# Altium project B100.PrjPcb (part 1 of 3)
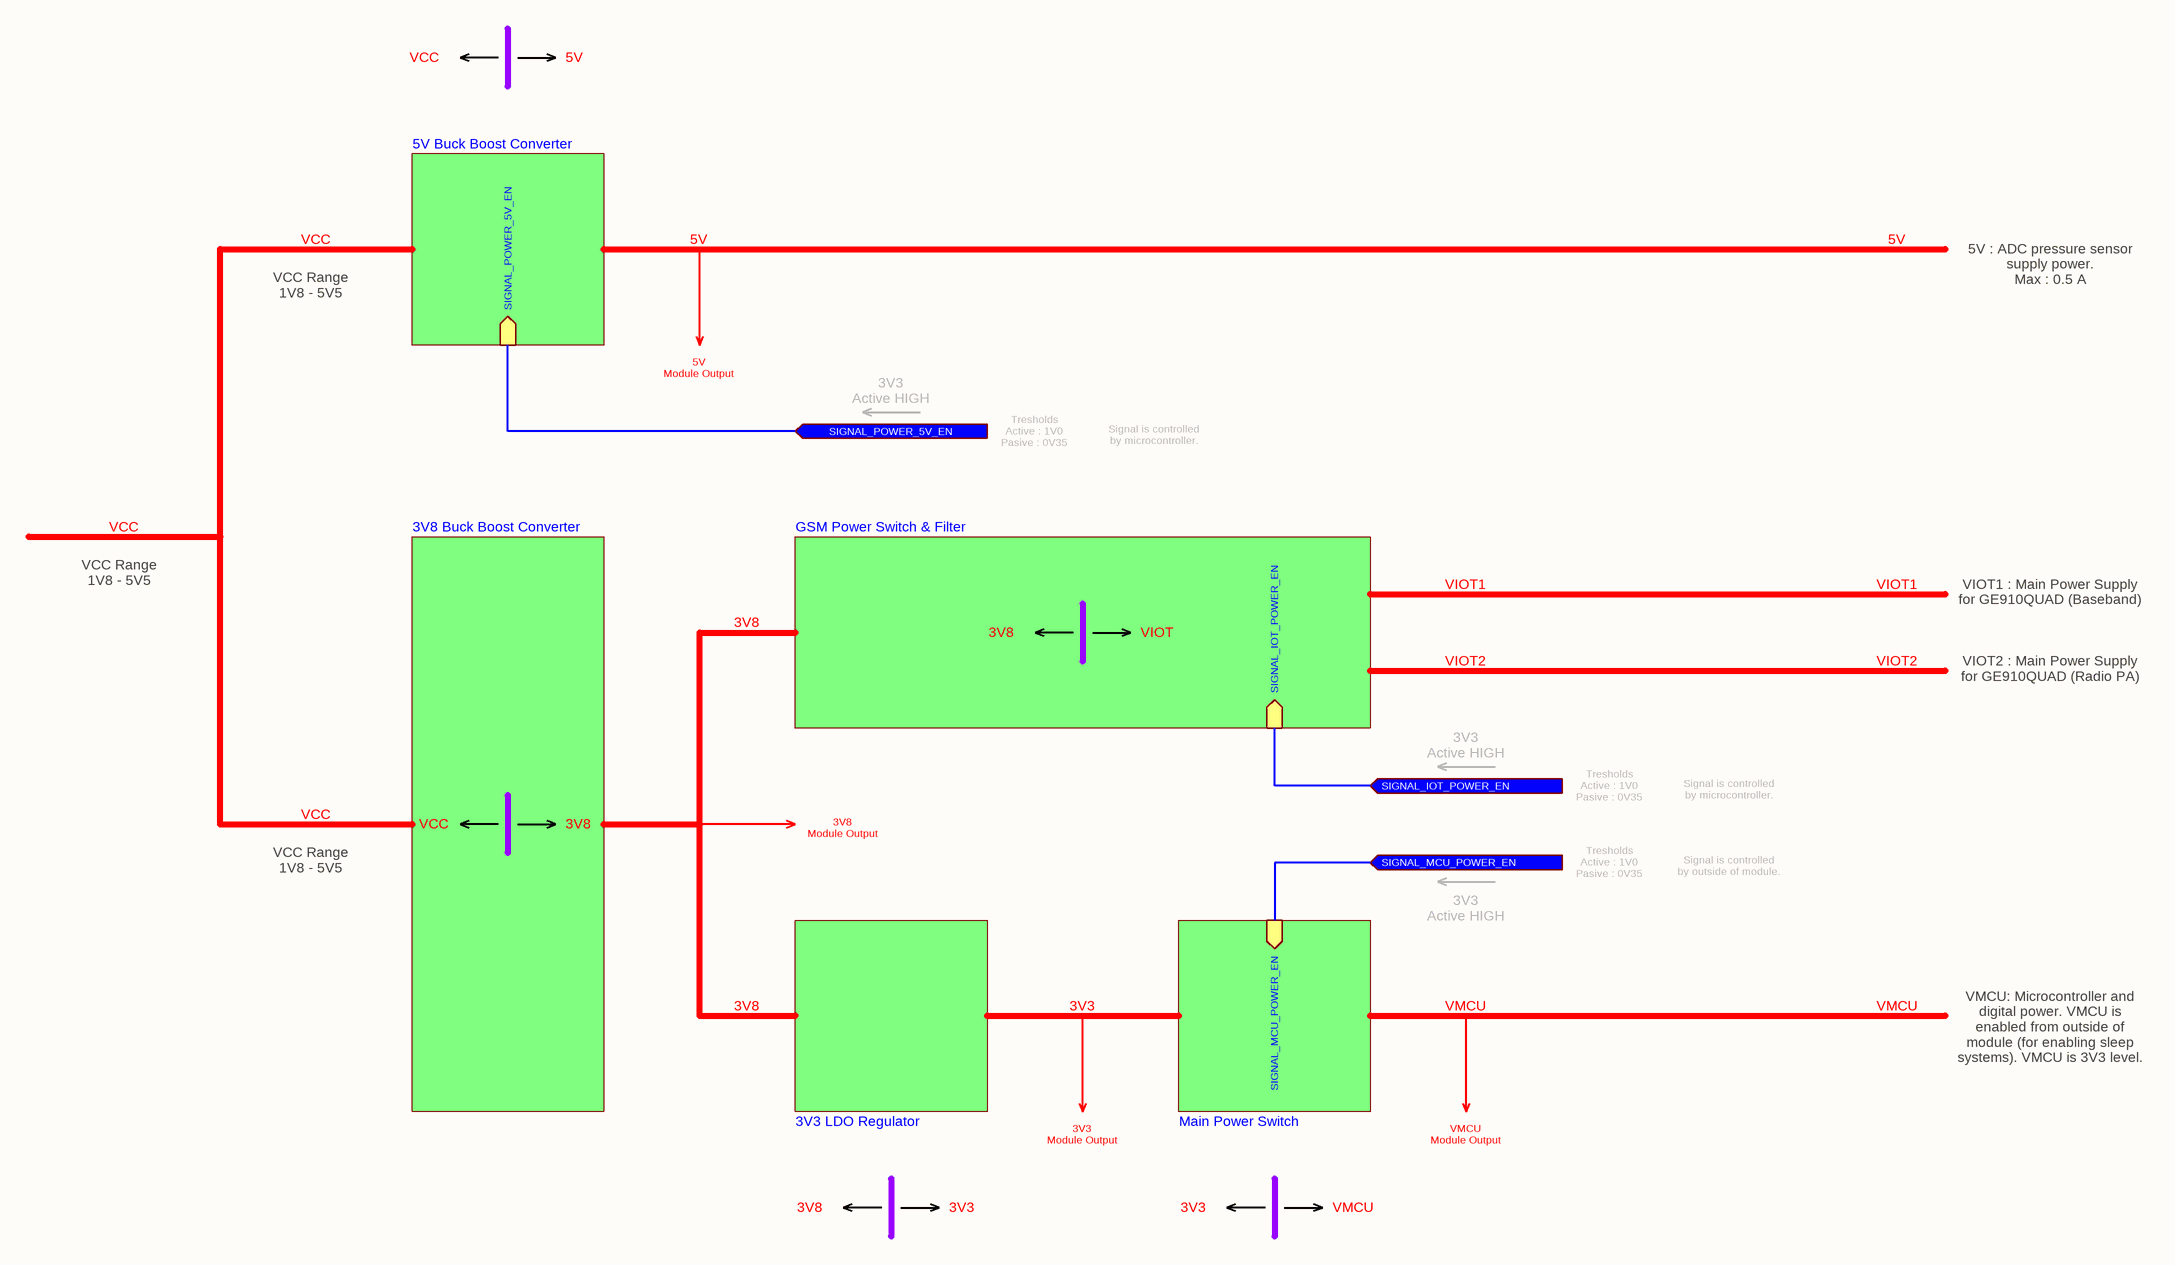
[diagram p0: Power Source.SchDoc]
Version_: AA; Title_: Power Source Segment Block Diagram; Revision_: R06; Product_ID_: -; Product_Desc_: GSM Iot Based Plug&Play SOM; Phone_: +90 506 7444300; Organization_: Ovoo Electronics; Module_ID_: B100; link_: http://www.ovoo.me; Git_Repo_Address_: https://www.github.com/akkoyun/B100; Engineer_: Mehmet Günce Akkoyun; Customer_: -; Address4_: Turkiye; Address3_: Meram / Konya; Address2_: Birgül Apt. No: 19/6; Address1_: Necip Fazýl Mah. Ortaýrmak Sok.
26 sheets, 171 parts. Net scope: hierarchical (ports join the sheet entries above them; power ports are global).
Board file: B100AA PCB R1.PcbDoc
Sheets:
  Power Source.SchDoc
    3V8 Buck Boost Converter = 3V8 Buck Boost Converter.SchDoc
    5V Buck Boost Converter = 5V Buck Boost Converter.SchDoc
    GSM Power Switch & Filter = GSM Power.SchDoc
    Main Power Switch = Main Power Switch.SchDoc
  GE910QUAD Modem.SchDoc
  GSM LED Indicators.SchDoc
  Master MicroController.SchDoc
    Master MicroController Core = Master MicroController Core.SchDoc
    PORT A = Master MicroController Port A.SchDoc
    PORT B = Master MicroController Port B.SchDoc
    PORT C = Master MicroController Port C.SchDoc
    PORT E = Master MicroController Port E.SchDoc
    PORT F = Master MicroController Port F.SchDoc
    PORT G = Master MicroController Port G.SchDoc
    PORT H = Master MicroController Port H.SchDoc
    PORT K = Master MicroController Port K.SchDoc
    Serial Communication = Master MicroController Serial Communication Port.SchDoc
  FOTA MicroController.SchDoc
  SD Card.SchDoc
  ICSP Burn Buffer.SchDoc
  I2C Network.SchDoc
    I2C Real Time Clock = Real Time Clock.SchDoc
  Filter Capacitors - Signal IoT.SchDoc
  Filter Capacitors - IoT UART.SchDoc
  Filter Capacitors - Port F.SchDoc

## Sheet Power Source.SchDoc: Power Architechture Block Diagram
size A3; ApprovedBy: Mehmet Günce Akkoyun; CheckedBy: Mehmet Günce Akkoyun; Author: Mehmet Günce Akkoyun; CompanyName: Ovoo Electronics; DrawnBy: Mehmet Günce Akkoyun; Engineer: Mehmet Günce Akkoyun; Organization: Ovoo Electronics; Address1: Necip Fazýl Mah. Ortaýrmak Sok.; Address2: Birgül Apt. No: 19/6; Address3: Meram / Konya; Address4: Turkiye; DocumentNumber: 2; Revision: R06; SheetNumber: 2; SheetTotal: 54

### Sub-sheets
3V3 LDO Regulator = 3V3 LDO Regulator.SchDoc (file not in this document): no entries
3V8 Buck Boost Converter = 3V8 Buck Boost Converter.SchDoc: no entries
5V Buck Boost Converter = 5V Buck Boost Converter.SchDoc: SIGNAL_POWER_5V_EN (in)
GSM Power Switch & Filter = GSM Power.SchDoc: SIGNAL_IOT_POWER_EN (in)
Main Power Switch = Main Power Switch.SchDoc: SIGNAL_MCU_POWER_EN (in)

### Ports
SIGNAL_IOT_POWER_EN (in), SIGNAL_MCU_POWER_EN (in), SIGNAL_POWER_5V_EN (in)

### Nets
NetC4_2: port SIGNAL_IOT_POWER_EN, sheet GSM Power Switch & Filter/SIGNAL_IOT_POWER_EN
NetC11_2: port SIGNAL_MCU_POWER_EN, sheet Main Power Switch/SIGNAL_MCU_POWER_EN
NetC234_2: port SIGNAL_POWER_5V_EN, sheet 5V Buck Boost Converter/SIGNAL_POWER_5V_EN

### Notes on the sheet
- VCC
- 5V
- VCC Range
  1V8 - 5V5
- 5V
  Module Output
- 5V : ADC pressure sensor supply power.
  Max : 0.5 A
- 3V3
  Active HIGH
- Tresholds
  Active : 1V0
  Pasive : 0V35
- Signal is controlled by microcontroller.
- 3V8
- VIOT
- VIOT2
- VIOT1
- VIOT1 : Main Power Supply for GE910QUAD (Baseband)
- VIOT2 : Main Power Supply for GE910QUAD (Radio PA)
- 3V8
  Module Output
- Signal is controlled by outside of module.
- 3V3
- VMCU
- 3V3
  Module Output
- VMCU
  Module Output
- VMCU: Microcontroller and digital power. VMCU is enabled from outside of module (for enabling sleep systems). VMCU is 3V3 level.
- Engineer
- All Rights are reserved to Customer and Engineer. [2021]
- Size:
- Date:
- A3
- Project :
- Time:
- Sheet
- of
- Customer
- Product ID
- Module ID
- Version
- File:
- Revision

## Sheet 3V8 Buck Boost Converter.SchDoc: 3V8 DC/DC Buck Boost Converter
size A4; ApprovedBy: Mehmet Günce Akkoyun; CheckedBy: Mehmet Günce Akkoyun; Author: Mehmet Günce Akkoyun; CompanyName: Ovoo Electronics; DrawnBy: Mehmet Günce Akkoyun; Engineer: Mehmet Günce Akkoyun; Organization: Ovoo Electronics; Address1: Necip Fazýl Mah. Ortaýrmak Sok.; Address2: Birgül Apt. No: 19/6; Address3: Meram / Konya; Address4: Turkiye; DocumentNumber: 3; Revision: R06; SheetNumber: 3; SheetTotal: 54
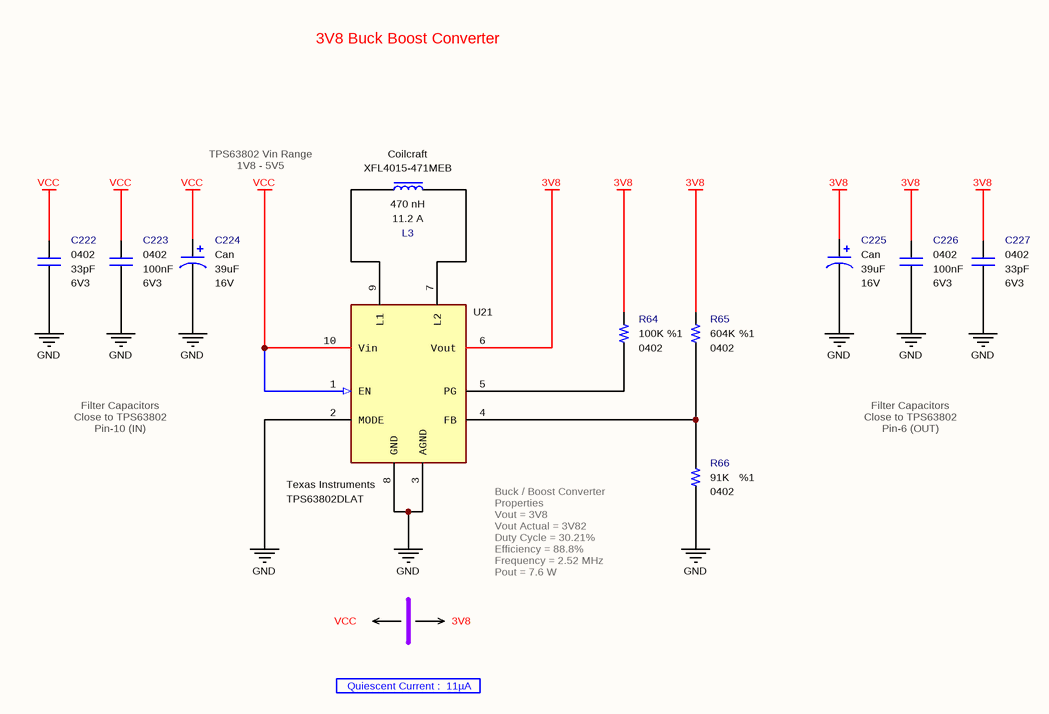
[diagram p1: 3V8 Buck Boost Converter.SchDoc]

### Parts
C222  value 33pF  Case: 0402  Voltage: 6V3  [CAPACITOR_0402]  (hidden comment: Multilayer Ceramic Capacitor)
C223  value 100nF  Case: 0402  Voltage: 6V3  [CAPACITOR_0402]  (hidden comment: Multilayer Ceramic Capacitor)
C224  value 39uF  Case: Can  Voltage: 16V  [CAPACITOR_CAN-B6]  (hidden comment: Aluminium Organic Polymer Capacitors)
C225  value 39uF  Case: Can  Voltage: 16V  [CAPACITOR_CAN-B6]  (hidden comment: Aluminium Organic Polymer Capacitors)
C226  value 100nF  Case: 0402  Voltage: 6V3  [CAPACITOR_0402]  (hidden comment: Multilayer Ceramic Capacitor)
C227  value 33pF  Case: 0402  Voltage: 6V3  [CAPACITOR_0402]  (hidden comment: Multilayer Ceramic Capacitor)
L3  value 470 nH  Maximum DC Current: 11.2 A  Manufacturer Part Number: XFL4015-471MEB  Manufacturer Name: Coilcraft  [INDUCTOR_XFL4015]  (hidden comment: Fixed Inductor)
R64  value 100K  Tolerance: %1  Case: 0402  [RESISTOR_0402]  (hidden comment: Thick Film Resistor)
R65  value 604K  Tolerance: %1  Case: 0402  [RESISTOR_0402]  (hidden comment: Thick Film Resistor)
R66  value 91K  Tolerance: %1  Case: 0402  [RESISTOR_0402]  (hidden comment: Thick Film Resistor)
U21  Manufacturer Part Number: TPS63802DLAT  Manufacturer Name: Texas Instruments  [VSON-10]  (hidden comment: Buck-Boost Converter)

### Nets
3V8: C225.1 C226.1 C227.2 R64.2 R65.2 U21.6(Vout)
GND: C222.1 C223.2 C224.2 C225.2 C226.2 C227.1 R66.1 U21.2(MODE) U21.3(AGND) U21.8(GND)
VCC: C222.2 C223.1 C224.1 U21.1(EN) U21.10(Vin)
NetL3_1: L3.1 U21.9(L1)
NetL3_2: L3.2 U21.7(L2)
NetR64_1: R64.1 U21.5(PG)
NetR65_1: R65.1 R66.2 U21.4(FB)

### Notes on the sheet
- 3V8 Buck Boost Converter
- TPS63802 Vin Range
  1V8 - 5V5
- Filter Capacitors
  Close to TPS63802
  Pin-10 (IN)
- Filter Capacitors
  Close to TPS63802
  Pin-6 (OUT)
- VCC
- 3V8
- Buck / Boost Converter Properties
  Vout = 3V8
  Vout Actual = 3V82
  Duty Cycle = 30.21%
  Efficiency = 88.8%
  Frequency = 2.52 MHz
  Pout = 7.6 W
- Quiescent Current :  11µA
- Engineer
- All Rights are reserved to Customer and Engineer. [2021]
- Size:
- Date:
- A4
- Project :
- Time:
- Sheet
- of
- Customer
- Product ID
- Module ID
- Version
- File:
- Revision

### Library data of the parts
C222 C227 = Capacitor - 33pF [0402-6V3]: Capacitor - 33pF [0402] (Ceramic); Manufacturer Name: Kemet; Manufacturer Part Number: C0402C330J9RACAUTO; Dielectric: X7R; Tolerance: 10%; Height: 0.5mm; Maximum Operating Temperature: +125; Minimum Operating Temperature: -55; ROHS: Yes; ComponentLink1Description: DataSheet; ComponentLink1URL: https://api.kemet.com/component-edge/download/datasheet/C0402C330J9RACAUTO.pdf; ComponentLink2Description: Mouser; ComponentLink2URL: https://www.mouser.com/Search/Refine.aspx?Keyword=80-C0402C330J9RAUTO; Supplier 1: Mouser; Supplier Part Number 1: 80-C0402C330J9RAUTO; Mouser Part Number: 80-C0402C330J9RAUTO
C223 C226 = Capacitor - 100nF [0402-6V3]: Capacitor - 100nF [0402-6V3] (Ceramic); Manufacturer Name: AVX; Manufacturer Part Number: 04026D104KAT4A; Dielectric: X5R; Tolerance: %10; Height: 0.25mm; ComponentLink1Description: Mouser; ComponentLink1URL: https://www.mouser.com.tr/ProductDetail/AVX/04026D104KAT4A?qs=sGAEpiMZZMs0AnBnWHyRQPg4iYkCw7IMED%2F4kpqgf7w%3D; ComponentLink2Description: DataSheet; ComponentLink2URL: https://www.mouser.com.tr/datasheet/2/40/cx5r-776519.pdf; ROHS: Yes; Maximum Operating Temperature: +85; Minimum Operating Temperature: -55; Supplier 1: Avnet; Supplier Part Number 1: 04026D104KAT4A; Mouser Part Number: 581-04026D104KAT4A
C224 C225 = Capacitor - 39uF [Can-16V]: Capacitor - 39uF 16V [Can] (Electrolytic); Manufacturer Name: Panasonic; Manufacturer Part Number: 16SVPC39MV; Leakage Current: 300uA; Tolerance: 20%; ESR: 27 mOhms; Height: 6mm; Maximum Operating Temperature: +105; Minimum Operating Temperature: -55; ROHS: Yes; ComponentLink1Description: DataSheet; ComponentLink1URL: https://www.mouser.com.tr/datasheet/2/315/SVPC_OS-1197065.pdf; ComponentLink2Description: Mouser; ComponentLink2URL: https://www.mouser.com.tr/ProductDetail/Panasonic/16SVPC39MV?qs=%2Fha2pyFadujpu3ATUg5hwJ6EWbTfmGGWJDu5kzoHUqwaZzNIr7t5GA%3D%3D; Supplier 1: Mouser; Supplier 2: Digi-Key; Supplier Part Number 2: P16473CT-ND; Supplier Part Number 1: 667-16SVPC39MV; Mouser Part Number: 667-16SVPC39MV
L3 = Inductor - 470 nH [SMD]: Fixed Inductors 0.47uH 20% 11.2A 8.36mOhms AEC-Q200; Height: 1.6mm; ComponentLink1Description: DataSheet; ComponentLink1URL: https://eu.mouser.com/datasheet/2/597/xfl4015-270755.pdf; ComponentLink2Description: Mouser; ComponentLink2URL: https://eu.mouser.com/ProductDetail/Coilcraft/XFL4015-471MEB?qs=VJjuEbE9QBO6UaDdUAgr%252Bw%3D%3D; Maximum DC Resistance: 8.36 mOhms; Maximum Operating Temperature: +125; Minimum Operating Temperature: -40; Tolerance: 20%; Supplier 1: Mouser; Supplier 2: Farnell; Supplier 3: Digi-Key; Supplier 4: Newark; Supplier Part Number 1: 710-7443551130; Supplier Part Number 2: 1869775; Supplier Part Number 4: 32T8562; Supplier Part Number 3: 732-1124-1-ND; Case: XFL4015; Mouser Part Number: 994-XFL4015-471MEB
R64 = Resistor - 100K: Thick Film Resistors - SMD 1/16 W 100 Kohms 1%; Manufacturer Name: Vishay; Manufacturer Part Number: CRCW0402100KFKED; Height: 0.35mm; ComponentLink1Description: DataSheet; ComponentLink1URL: https://www.mouser.com.tr/datasheet/2/427/dcrcwe3-1762152.pdf; ComponentLink2Description: Mouser; ComponentLink2URL: https://eu.mouser.com/ProductDetail/Vishay-Dale/CRCW0402100KFKED?qs=OlqPY1CiralZGKRwQ4Glcg%3D%3D; Supplier 1: Future Electronics; Supplier 2: Future Electronics; Supplier 3: Arrow; Supplier 4: Farnell; Supplier 5: Digi-Key; Supplier Part Number 1: CRCW0402100KFKED-CUTT; Supplier Part Number 2: CRCW0402100KFKED-REEL; Supplier Part Number 3: CRCW0402100KFKED; Supplier Part Number 4: 2121857; Supplier Part Number 5: 541-100KLCT-ND; Mouser Part Number: 71-CRCW0402-100K-E3
R65 = Resistor - 604K: Thick Film Resistors - SMD 1/16 W 604 Kohms 1%; Manufacturer Name: Vishay; Manufacturer Part Number: CRCW0402604KFKED; Height: 0.35mm; ComponentLink1Description: DataSheet; ComponentLink1URL: https://eu.mouser.com/datasheet/2/427/dcrcwe3-1762152.pdf; ComponentLink2Description: Mouser; ComponentLink2URL: https://eu.mouser.com/ProductDetail/Vishay-Dale/CRCW0402604KFKED?qs=DKbL89i6OEpzv5ZGRZfINw%3D%3D; Supplier 1: Mouser; Supplier 2: Digi-Key; Supplier Part Number 1: 71-CRCW0402390KFKED; Supplier Part Number 2: 541-390KLCT-ND; Mouser Part Number: 71-CRCW0402-604K-E3
R66 = Resistor - 91K: Thick Film Resistors - SMD 1/16 W 91 Kohms 1%; Manufacturer Name: Vishay; Manufacturer Part Number: CRCW040291K0FKED; Height: 0.35mm; ComponentLink1Description: DataSheet; ComponentLink1URL: https://eu.mouser.com/datasheet/2/427/dcrcwe3-1762152.pdf; ComponentLink2Description: Mouser; ComponentLink2URL: https://eu.mouser.com/ProductDetail/Vishay-Dale/CRCW040291K0FKED?qs=Po1ctqG%2F82oNfd9H7rZeFQ%3D%3D; Supplier 1: Future Electronics; Supplier 2: Arrow; Supplier 3: Farnell; Supplier 4: Newark; Supplier 5: Digi-Key; Supplier Part Number 1: CRCW040291K0FKED-REEL; Supplier Part Number 2: CRCW040291K0FKED; Supplier Part Number 3: 2121853; Supplier Part Number 4: 24W2519; Supplier Part Number 5: 541-91.0KLCT-ND; Mouser Part Number: 71-CRCW040291K0FKED
U21 = IC - TPS63802DLAT: Switching Voltage Regulators High current, high efficiency single inductor buck-boost converter 10-VSON-HR -40 to 125; ComponentLink1Description: DataSheet; ComponentLink1URL: https://www.ti.com/lit/ds/symlink/tps63802.pdf?ts=1611132560608&ref_url=https%253A%252F%252Fwww.google.com%252F; ComponentLink2Description: Mouser; ComponentLink2URL: https://www.mouser.com.tr/ProductDetail/Maxim-Integrated/MAX17055ETB%2bT?qs=sGAEpiMZZMve4%2FbfQkoj%252BAs6FTSsQJaJrD7Z3v0Qe9M%3D; Minimum Operating Temperature: -40; Maximum Operating Temperature: +125; Supplier 1: Avnet; Supplier 2: Mouser; Supplier 3: Digi-Key; Supplier Part Number 1: TPS63802DLAT; Supplier Part Number 2: 595-TPS63802DLAT; Supplier Part Number 3: 296-TPS63802DLATCT-ND; Case: VSON-10; ComponentLink3Description: Product Page; ComponentLink3URL: https://www.ti.com/store/ti/en/p/product/?p=TPS63802DLAT; Mouser Part Number: 595-TPS63802DLAT

## Sheet 5V Buck Boost Converter.SchDoc: 5V DC/DC Buck Boost Converter
size A4; ApprovedBy: Mehmet Günce Akkoyun; CheckedBy: Mehmet Günce Akkoyun; Author: Mehmet Günce Akkoyun; CompanyName: Ovoo Electronics; DrawnBy: Mehmet Günce Akkoyun; Engineer: Mehmet Günce Akkoyun; Organization: Ovoo Electronics; Address1: Necip Fazýl Mah. Ortaýrmak Sok.; Address2: Birgül Apt. No: 19/6; Address3: Meram / Konya; Address4: Turkiye; DocumentNumber: 7; Revision: R06; SheetNumber: 7; SheetTotal: 54
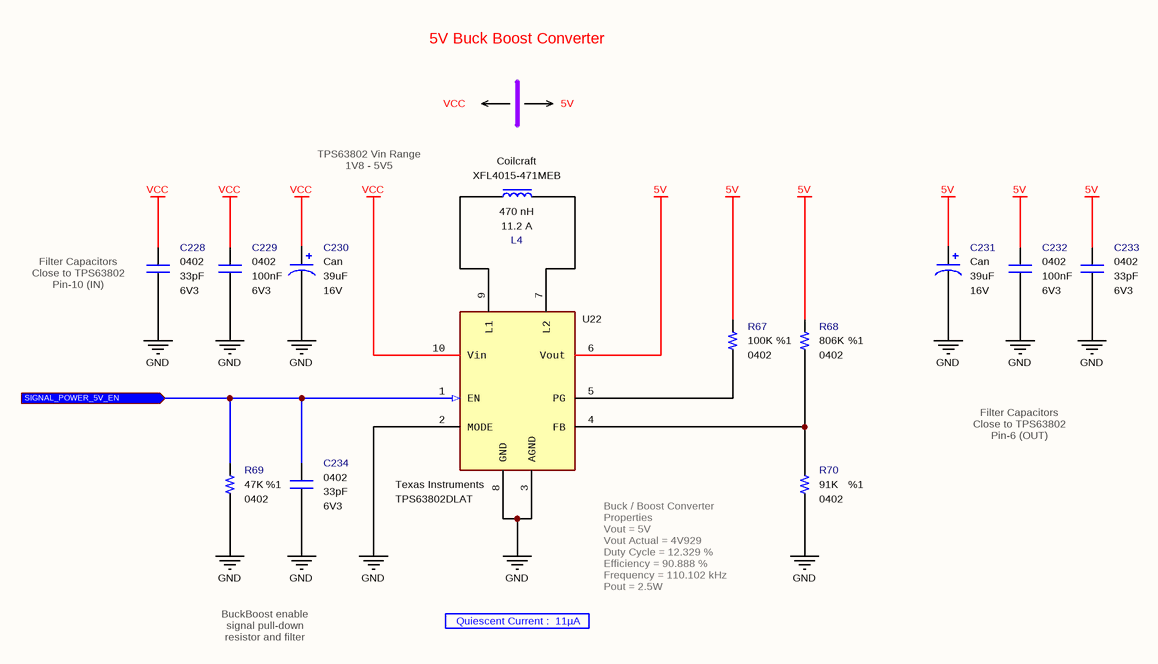
[diagram p2: 5V Buck Boost Converter.SchDoc]

### Parts
C228  value 33pF  Case: 0402  Voltage: 6V3  [CAPACITOR_0402]  (hidden comment: Multilayer Ceramic Capacitor)
C229  value 100nF  Case: 0402  Voltage: 6V3  [CAPACITOR_0402]  (hidden comment: Multilayer Ceramic Capacitor)
C230  value 39uF  Case: Can  Voltage: 16V  [CAPACITOR_CAN-B6]  (hidden comment: Aluminium Organic Polymer Capacitors)
C231  value 39uF  Case: Can  Voltage: 16V  [CAPACITOR_CAN-B6]  (hidden comment: Aluminium Organic Polymer Capacitors)
C232  value 100nF  Case: 0402  Voltage: 6V3  [CAPACITOR_0402]  (hidden comment: Multilayer Ceramic Capacitor)
C233  value 33pF  Case: 0402  Voltage: 6V3  [CAPACITOR_0402]  (hidden comment: Multilayer Ceramic Capacitor)
C234  value 33pF  Case: 0402  Voltage: 6V3  [CAPACITOR_0402]  (hidden comment: Multilayer Ceramic Capacitor)
L4  value 470 nH  Maximum DC Current: 11.2 A  Manufacturer Part Number: XFL4015-471MEB  Manufacturer Name: Coilcraft  [INDUCTOR_XFL4015]  (hidden comment: Fixed Inductor)
R67  value 100K  Tolerance: %1  Case: 0402  [RESISTOR_0402]  (hidden comment: Thick Film Resistor)
R68  value 806K  Tolerance: %1  Case: 0402  [RESISTOR_0402]  (hidden comment: Thick Film Resistor)
R69  value 47K  Tolerance: %1  Case: 0402  [RESISTOR_0402]  (hidden comment: Thick Film Resistor)
R70  value 91K  Tolerance: %1  Case: 0402  [RESISTOR_0402]  (hidden comment: Thick Film Resistor)
U22  Manufacturer Part Number: TPS63802DLAT  Manufacturer Name: Texas Instruments  [VSON-10]  (hidden comment: Buck-Boost Converter)

### Ports
SIGNAL_POWER_5V_EN (in)

### Nets
5V: C231.1 C232.1 C233.2 R67.2 R68.2 U22.6(Vout)
GND: C228.1 C229.2 C230.2 C231.2 C232.2 C233.1 C234.1 R69.1 R70.1 U22.2(MODE) U22.3(AGND) U22.8(GND)
VCC: C228.2 C229.1 C230.1 U22.10(Vin)
NetC234_2: C234.2 R69.2 U22.1(EN) ; port SIGNAL_POWER_5V_EN
NetL4_1: L4.1 U22.9(L1)
NetL4_2: L4.2 U22.7(L2)
NetR67_1: R67.1 U22.5(PG)
NetR68_1: R68.1 R70.2 U22.4(FB)

### Notes on the sheet
- 5V Buck Boost Converter
- VCC
- 5V
- TPS63802 Vin Range
  1V8 - 5V5
- (near C228) Filter Capacitors
  Close to TPS63802
  Pin-10 (IN)
- Filter Capacitors
  Close to TPS63802
  Pin-6 (OUT)
- BuckBoost enable signal pull-down resistor and filter capacitor.
- Quiescent Current :  11µA
- Buck / Boost Converter Properties
  Vout = 5V
  Vout Actual = 4V929
  Duty Cycle = 12.329 %
  Efficiency = 90.888 %
  Frequency = 110.102 kHz
  Pout = 2.5W
- Engineer
- All Rights are reserved to Customer and Engineer. [2021]
- Size:
- Date:
- A4
- Project :
- Time:
- Sheet
- of
- Customer
- Product ID
- Module ID
- Version
- File:
- Revision

### Library data of the parts
C228 C233 C234 = Capacitor - 33pF [0402-6V3]: as C222 on sheet 3V8 Buck Boost Converter; Height: 0.5mm; Maximum Operating Temperature: +125; Minimum Operating Temperature: -55; ROHS: Yes; ComponentLink1Description: DataSheet; ComponentLink1URL: https://api.kemet.com/component-edge/download/datasheet/C0402C330J9RACAUTO.pdf; ComponentLink2Description: Mouser; ComponentLink2URL: https://www.mouser.com/Search/Refine.aspx?Keyword=80-C0402C330J9RAUTO; Supplier 1: Mouser; Supplier Part Number 1: 80-C0402C330J9RAUTO; Mouser Part Number: 80-C0402C330J9RAUTO
C229 C232 = Capacitor - 100nF [0402-6V3]: as C223 on sheet 3V8 Buck Boost Converter; Height: 0.25mm; ComponentLink1Description: Mouser; ComponentLink1URL: https://www.mouser.com.tr/ProductDetail/AVX/04026D104KAT4A?qs=sGAEpiMZZMs0AnBnWHyRQPg4iYkCw7IMED%2F4kpqgf7w%3D; ComponentLink2Description: DataSheet; ComponentLink2URL: https://www.mouser.com.tr/datasheet/2/40/cx5r-776519.pdf; ROHS: Yes; Maximum Operating Temperature: +85; Minimum Operating Temperature: -55; Supplier 1: Avnet; Supplier Part Number 1: 04026D104KAT4A; Mouser Part Number: 581-04026D104KAT4A
C230 C231 = Capacitor - 39uF [Can-16V]: as C224 on sheet 3V8 Buck Boost Converter; Height: 6mm; Maximum Operating Temperature: +105; Minimum Operating Temperature: -55; ROHS: Yes; ComponentLink1Description: DataSheet; ComponentLink1URL: https://www.mouser.com.tr/datasheet/2/315/SVPC_OS-1197065.pdf; ComponentLink2Description: Mouser; ComponentLink2URL: https://www.mouser.com.tr/ProductDetail/Panasonic/16SVPC39MV?qs=%2Fha2pyFadujpu3ATUg5hwJ6EWbTfmGGWJDu5kzoHUqwaZzNIr7t5GA%3D%3D; Supplier 1: Mouser; Supplier 2: Digi-Key; Supplier Part Number 2: P16473CT-ND; Supplier Part Number 1: 667-16SVPC39MV; Mouser Part Number: 667-16SVPC39MV
L4 = Inductor - 470 nH [SMD]: as L3 on sheet 3V8 Buck Boost Converter; Height: 1.6mm; ComponentLink1Description: DataSheet; ComponentLink1URL: https://eu.mouser.com/datasheet/2/597/xfl4015-270755.pdf; ComponentLink2Description: Mouser; ComponentLink2URL: https://eu.mouser.com/ProductDetail/Coilcraft/XFL4015-471MEB?qs=VJjuEbE9QBO6UaDdUAgr%252Bw%3D%3D; Maximum DC Resistance: 8.36 mOhms; Maximum Operating Temperature: +125; Minimum Operating Temperature: -40; Tolerance: 20%; Supplier 1: Mouser; Supplier 2: Farnell; Supplier 3: Digi-Key; Supplier 4: Newark; Supplier Part Number 1: 710-7443551130; Supplier Part Number 2: 1869775; Supplier Part Number 4: 32T8562; Supplier Part Number 3: 732-1124-1-ND; Case: XFL4015; Mouser Part Number: 994-XFL4015-471MEB
R67 = Resistor - 100K: as R64 on sheet 3V8 Buck Boost Converter; Height: 0.35mm; ComponentLink1Description: DataSheet; ComponentLink1URL: https://www.mouser.com.tr/datasheet/2/427/dcrcwe3-1762152.pdf; ComponentLink2Description: Mouser; ComponentLink2URL: https://eu.mouser.com/ProductDetail/Vishay-Dale/CRCW0402100KFKED?qs=OlqPY1CiralZGKRwQ4Glcg%3D%3D; Supplier 1: Future Electronics; Supplier 2: Future Electronics; Supplier 3: Arrow; Supplier 4: Farnell; Supplier 5: Digi-Key; Supplier Part Number 1: CRCW0402100KFKED-CUTT; Supplier Part Number 2: CRCW0402100KFKED-REEL; Supplier Part Number 3: CRCW0402100KFKED; Supplier Part Number 4: 2121857; Supplier Part Number 5: 541-100KLCT-ND; Mouser Part Number: 71-CRCW0402-100K-E3
R68 = Resistor - 806K: Thick Film Resistors - SMD 1/16 W 806 Kohms 1%; Manufacturer Name: Vishay; Manufacturer Part Number: CRCW0402806KFKED; Height: 0.35mm; ComponentLink1Description: DataSheet; ComponentLink1URL: https://www.mouser.com.tr/datasheet/2/427/dcrcwe3-1762152.pdf; ComponentLink2Description: Mouser; ComponentLink2URL: https://www.mouser.com.tr/ProductDetail/Vishay-Dale/CRCW0402806KFKED/?qs=cra7cYzOg1xpxTzRs9o4Mw%3D%3D; Supplier 1: Avnet; Supplier 2: Future Electronics; Supplier 3: Future Electronics; Supplier 4: Mouser; Supplier 5: Farnell; Supplier 6: Newark; Supplier 7: Digi-Key; Supplier 8: Digi-Key; Supplier 9: Newark; Supplier 10: Digi-Key; Supplier Part Number 1: CRCW0402806KFKED; Supplier Part Number 2: 7425135; Supplier Part Number 3: 9019379; Supplier Part Number 4: 71-CRCW0402-806K-E3; Supplier Part Number 5: 2141028; Supplier Part Number 6: 52K7299; Supplier Part Number 7: 541-806KLCT-ND; Supplier Part Number 8: 541-806KLDKR-ND; Supplier Part Number 9: 26W9212; Supplier Part Number 10: 541-806KLTR-ND; Mouser Part Number: 71-CRCW0402-806K-E3
R69 = Resistor - 47K: Thick Film Resistors - SMD 1/16 W 47 Kohms 1%; Manufacturer Name: Vishay; Manufacturer Part Number: CRCW040247K0FKED; Height: 0.4mm; ComponentLink1Description: DataSheet; ComponentLink1URL: https://www.mouser.com.tr/datasheet/2/427/dcrcwe3-1762152.pdf; ComponentLink2Description: Mouser; ComponentLink2URL: https://www.mouser.com.tr/ProductDetail/Vishay-Dale/CRCW040247K0FKED?qs=sGAEpiMZZMu61qfTUdNhG2DpbjADlD3GL%252B3h1elTxqU%3D; Supplier 1: Mouser; Supplier 2: Digi-Key; Supplier Part Number 1: 71-CRCW040247K0FKEDH; Supplier Part Number 2: 541-47.0KYCT-ND; Mouser Part Number: 71-CRCW0402-47K-E3
R70 = Resistor - 91K: as R66 on sheet 3V8 Buck Boost Converter; Height: 0.35mm; ComponentLink1Description: DataSheet; ComponentLink1URL: https://eu.mouser.com/datasheet/2/427/dcrcwe3-1762152.pdf; ComponentLink2Description: Mouser; ComponentLink2URL: https://eu.mouser.com/ProductDetail/Vishay-Dale/CRCW040291K0FKED?qs=Po1ctqG%2F82oNfd9H7rZeFQ%3D%3D; Supplier 1: Future Electronics; Supplier 2: Arrow; Supplier 3: Farnell; Supplier 4: Newark; Supplier 5: Digi-Key; Supplier Part Number 1: CRCW040291K0FKED-REEL; Supplier Part Number 2: CRCW040291K0FKED; Supplier Part Number 3: 2121853; Supplier Part Number 4: 24W2519; Supplier Part Number 5: 541-91.0KLCT-ND; Mouser Part Number: 71-CRCW040291K0FKED
U22 = IC - TPS63802DLAT: as U21 on sheet 3V8 Buck Boost Converter; ComponentLink1Description: DataSheet; ComponentLink1URL: https://www.ti.com/lit/ds/symlink/tps63802.pdf?ts=1611132560608&ref_url=https%253A%252F%252Fwww.google.com%252F; ComponentLink2Description: Mouser; ComponentLink2URL: https://www.mouser.com.tr/ProductDetail/Maxim-Integrated/MAX17055ETB%2bT?qs=sGAEpiMZZMve4%2FbfQkoj%252BAs6FTSsQJaJrD7Z3v0Qe9M%3D; Minimum Operating Temperature: -40; Maximum Operating Temperature: +125; Supplier 1: Avnet; Supplier 2: Mouser; Supplier 3: Digi-Key; Supplier Part Number 1: TPS63802DLAT; Supplier Part Number 2: 595-TPS63802DLAT; Supplier Part Number 3: 296-TPS63802DLATCT-ND; Case: VSON-10; ComponentLink3Description: Product Page; ComponentLink3URL: https://www.ti.com/store/ti/en/p/product/?p=TPS63802DLAT; Mouser Part Number: 595-TPS63802DLAT

## Sheet GSM Power.SchDoc: GSM Power Switch and Filter
size A4; ApprovedBy: Mehmet Günce Akkoyun; CheckedBy: Mehmet Günce Akkoyun; Author: Mehmet Günce Akkoyun; CompanyName: Ovoo Electronics; DrawnBy: Mehmet Günce Akkoyun; Engineer: Mehmet Günce Akkoyun; Organization: Ovoo Electronics; Address1: Necip Fazýl Mah. Ortaýrmak Sok.; Address2: Birgül Apt. No: 19/6; Address3: Meram / Konya; Address4: Turkiye; DocumentNumber: 4; Revision: R06; SheetNumber: 4; SheetTotal: 54
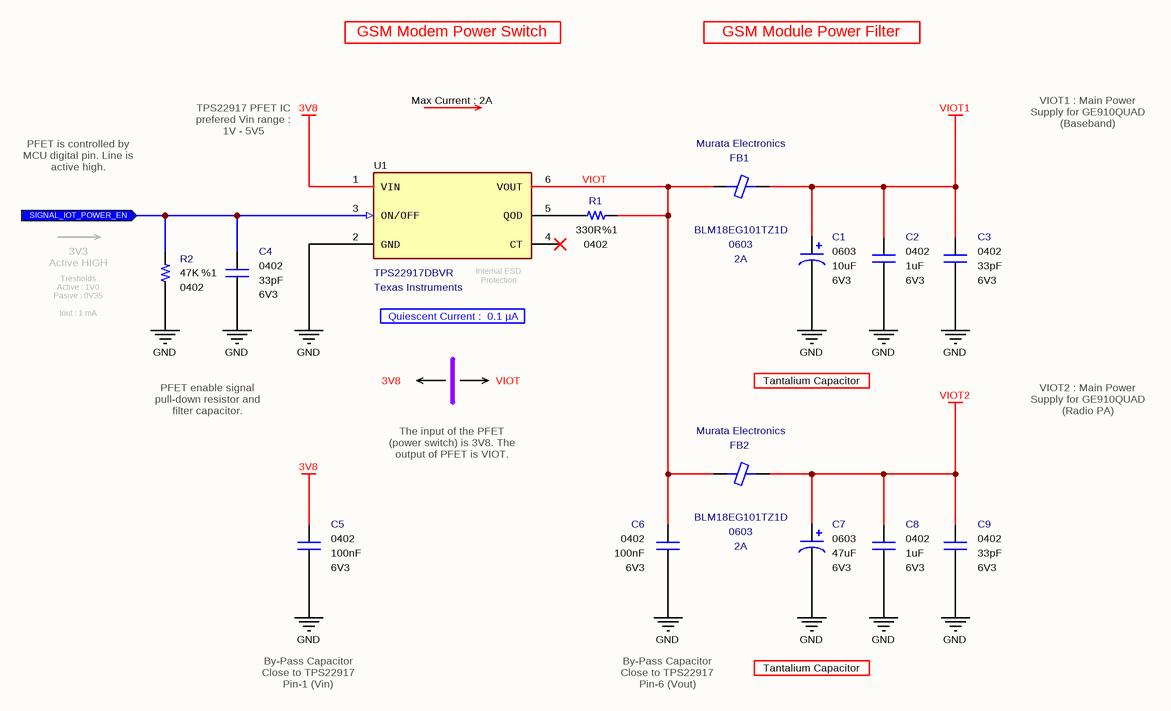
[diagram p3: GSM Power.SchDoc]

### Parts
C1  value 10uF  Case: 0603  Voltage: 6V3  [CAPACITOR_0603 - TANTALUM]  (hidden comment: Tantalum Capacitor)
C2  value 1uF  Case: 0402  Voltage: 6V3  [CAPACITOR_0402]  (hidden comment: Multilayer Ceramic Capacitor)
C3  value 33pF  Case: 0402  Voltage: 6V3  [CAPACITOR_0402]  (hidden comment: Multilayer Ceramic Capacitor)
C4  value 33pF  Case: 0402  Voltage: 6V3  [CAPACITOR_0402]  (hidden comment: Multilayer Ceramic Capacitor)
C5  value 100nF  Case: 0402  Voltage: 6V3  [CAPACITOR_0402]  (hidden comment: Multilayer Ceramic Capacitor)
C6  value 100nF  Case: 0402  Voltage: 6V3  [CAPACITOR_0402]  (hidden comment: Multilayer Ceramic Capacitor)
C7  value 47uF  Case: 0603  Voltage: 6V3  [CAPACITOR_0603 - TANTALUM]  (hidden comment: Tantalum Capacitor)
C8  value 1uF  Case: 0402  Voltage: 6V3  [CAPACITOR_0402]  (hidden comment: Multilayer Ceramic Capacitor)
C9  value 33pF  Case: 0402  Voltage: 6V3  [CAPACITOR_0402]  (hidden comment: Multilayer Ceramic Capacitor)
FB1  value BLM18EG101TZ1D  Case: 0603  Maximum DC Current: 2A  Manufacturer Name: Murata Electronics  [INDUCATOR_0603]  (hidden comment: Ferrite Bead)
FB2  value BLM18EG101TZ1D  Case: 0603  Maximum DC Current: 2A  Manufacturer Name: Murata Electronics  [INDUCATOR_0603]  (hidden comment: Ferrite Bead)
R1  value 330R  Tolerance: %1  Case: 0402  [RESISTOR_0402]  (hidden comment: Thick Film Resistor)
R2  value 47K  Tolerance: %1  Case: 0402  [RESISTOR_0402]  (hidden comment: Thick Film Resistor)
U1  Manufacturer Part Number: TPS22917DBVR  Manufacturer Name: Texas Instruments  [SOT-23-6]  (hidden comment: Power Switch)

### Ports
SIGNAL_IOT_POWER_EN (in)

### Nets
3V8: C5.1 U1.1(VIN)
GND: C1.2 C2.1 C3.1 C4.1 C5.2 C6.2 C7.2 C8.1 C9.1 R2.1 U1.2(GND)
VIOT1: C1.1 C2.2 C3.2 FB1.2
VIOT2: C7.1 C8.2 C9.2 FB2.2
VIOT: C6.1 FB1.1 FB2.1 R1.1 U1.6(VOUT)
NetC4_2: C4.2 R2.2 U1.3(ON/OFF) ; port SIGNAL_IOT_POWER_EN
NetR1_2: R1.2 U1.5(QOD)

Not connected (* = marked no-connect by the designer): U1 4(CT)*

### Notes on the sheet
- GSM Modem Power Switch
- GSM Module Power Filter
- TPS22917 PFET IC prefered Vin range : 1V - 5V5
- Max Current : 2A
- VIOT1 : Main Power Supply for GE910QUAD (Baseband)
- PFET is controlled by MCU digital pin. Line is active high.
- (near R2) 3V3
  Active HIGH
- (near U1) Internal ESD Protection
- (near R2) Tresholds
  Active : 1V0
  Pasive : 0V35
  Iout : 1 mA
- Quiescent Current :  0.1 µA
- PFET enable signal pull-down resistor and filter capacitor.
- 3V8
- VIOT
- Tantalium Capacitor
- VIOT2 : Main Power Supply for GE910QUAD (Radio PA)
- The input of the PFET (power switch) is 3V8. The output of PFET is VIOT.
- By-Pass Capacitor
  Close to TPS22917
  Pin-1 (Vin)
- By-Pass Capacitor
  Close to TPS22917
  Pin-6 (Vout)
- Engineer
- All Rights are reserved to Customer and Engineer. [2021]
- Size:
- Date:
- A4
- Project :
- Time:
- Sheet
- of
- Customer
- Product ID
- Module ID
- Version
- File:
- Revision

### Library data of the parts
C1 = Capacitor - 10uF [0603-6V3] (Tantalium): Capacitor - 10uF [0603] (Tantalium); Manufacturer Name: AVX; Manufacturer Part Number: F380J106MMAAH3; ESR: 200 mOhms; Leakage Current: 10uA; Tolerance: 20%; Height: 0.8mm; Maximum Operating Temperature: +105; Minimum Operating Temperature: -55; ROHS: Yes; ComponentLink1Description: DataSheet; ComponentLink1URL: https://www.mouser.com.tr/datasheet/2/40/f38-775706.pdf; ComponentLink2Description: Mouser; ComponentLink2URL: https://www.mouser.com.tr/ProductDetail/AVX/F380J106MMAAH3?qs=sGAEpiMZZMtZ1n0r9vR22fixilZl6Mr8zRKleESmvcDFwZ4LSyC6Pg%3D%3D; Supplier 1: Mouser; Supplier 2: Digi-Key; Supplier Part Number 2: 478-12031-1-ND; Supplier Part Number 1: 581-F380J106MMAAH3; Mouser Part Number: 581-F380J106MMAAH3
C2 C8 = Capacitor - 1uF [0402-6V3]: Capacitor - 1uF [0402] (Ceramic); Manufacturer Name: Murata Electronics; Manufacturer Part Number: GRM153R60J105ME95D; Dielectric: X5R; Tolerance: 20%; Height: 0.3mm; Maximum Operating Temperature: +85; Minimum Operating Temperature: -55; RoHS: Yes; Weight: 6mg; ComponentLink1Description: DataSheet; ComponentLink1URL: https://psearch.en.murata.com/capacitor/product/GRM153R60J105ME95%23.html; ComponentLink2Description: Mouser; ComponentLink2URL: https://www.mouser.com/Search/Refine.aspx?Keyword=81-GRM153R60J105ME5D; Supplier 1: Future Electronics; Supplier 2: Future Electronics; Supplier 3: Mouser; Supplier 4: Arrow; Supplier 5: Digi-Key; Supplier Part Number 5: 490-14576-1-ND; Supplier Part Number 4: GRM153R60J105ME95D; Supplier Part Number 3: 81-GRM153R60J105ME5D; Supplier Part Number 2: GRM153R60J105ME95D-REEL; Supplier Part Number 1: GRM153R60J105ME95D-CUTT; Mouser Part Number: 81-GRM153R60J105ME5D
C3 C4 C9 = Capacitor - 33pF [0402-6V3]: as C222 on sheet 3V8 Buck Boost Converter; Height: 0.5mm; Maximum Operating Temperature: +125; Minimum Operating Temperature: -55; ROHS: Yes; ComponentLink1Description: DataSheet; ComponentLink1URL: https://api.kemet.com/component-edge/download/datasheet/C0402C330J9RACAUTO.pdf; ComponentLink2Description: Mouser; ComponentLink2URL: https://www.mouser.com/Search/Refine.aspx?Keyword=80-C0402C330J9RAUTO; Supplier 1: Mouser; Supplier Part Number 1: 80-C0402C330J9RAUTO; Mouser Part Number: 80-C0402C330J9RAUTO
C5 C6 = Capacitor - 100nF [0402-6V3]: as C223 on sheet 3V8 Buck Boost Converter; Height: 0.25mm; ComponentLink1Description: Mouser; ComponentLink1URL: https://www.mouser.com.tr/ProductDetail/AVX/04026D104KAT4A?qs=sGAEpiMZZMs0AnBnWHyRQPg4iYkCw7IMED%2F4kpqgf7w%3D; ComponentLink2Description: DataSheet; ComponentLink2URL: https://www.mouser.com.tr/datasheet/2/40/cx5r-776519.pdf; ROHS: Yes; Maximum Operating Temperature: +85; Minimum Operating Temperature: -55; Supplier 1: Avnet; Supplier Part Number 1: 04026D104KAT4A; Mouser Part Number: 581-04026D104KAT4A
C7 = Capacitor - 47u [0603-6V3] (Tantalium): Capacitor - 47uF [0603] (Tantalium); Manufacturer Name: AVX; Manufacturer Part Number: F380J476MMAAXEH3; ESR: 300 mOhms; Leakage Current: 59.2uA; Tolerance: 20%; Height: 0.8 mm; Maximum Operating Temperature: +105; Minimum Operating Temperature: -55; ROHS: Yes; Weight: 2mg; ComponentLink1Description: DataSheet; ComponentLink1URL: https://www.mouser.com.tr/datasheet/2/40/f38-775706.pdf; ComponentLink2Description: Mouser; ComponentLink2URL: https://www.mouser.com.tr/ProductDetail/AVX/F380J476MMAAXEH3?qs=sGAEpiMZZMtZ1n0r9vR22RxGXmrWTp1dAwL15%252BtiGosce1Uk5KTrYw%3D%3D; Supplier 1: Avnet; Supplier Part Number 1: F380J476MMAAXEH3; Mouser Part Number: 581-F380J476MMAAXEH3
FB1 FB2 = Ferrite Bead - 2A [0603]: Ferrite Beads 0603 100ohms 2000mA Auto Infotainment; Tolerance: 25%; Maximum DC Resistance: 45 mOhms; Height: 0.75mm; ROHS: Yes; Minimum Operating Temperature: -55; Maximum Operating Temperature: +125; Impedance: 100 Ohms; ComponentLink1Description: DataSheet; ComponentLink1URL: http://www.murata.com/~/media/webrenewal/support/library/catalog/products/emc/emifil/c31e.ashx?la=en-gb; ComponentLink2Description: Mouser; ComponentLink2URL: https://www.mouser.com/Search/Refine.aspx?Keyword=81-BLM18EG101TZ1D; Supplier 1: Mouser; Supplier Part Number 1: 81-BLM18EG101TZ1D; Manufacturer Part Number: BLM18EG101TZ1D; Mouser Part Number: 81-BLM18EG101TZ1D; Mouser Price/Stock: https://www.mouser.com/Search/Refine.aspx?Keyword=81-BLM18EG101TZ1D
R1 = Resistor - 330R: Thick Film Resistors - SMD 1/16 W 330 Ohm 1%; Manufacturer Name: Vishay; Manufacturer Part Number: CRCW0402330RFKED; Height: 0.4mm; ComponentLink1Description: DataSheet; ComponentLink1URL: https://www.mouser.com.tr/datasheet/2/427/dcrcwe3-1762152.pdf; ComponentLink2Description: Mouser; ComponentLink2URL: https://www.mouser.com.tr/ProductDetail/Vishay-Dale/CRCW0402330RFKED?qs=sGAEpiMZZMu61qfTUdNhG2DpbjADlD3GGS6SwBlLi5Q%3D; Supplier 1: Mouser; Supplier 2: Digi-Key; Supplier Part Number 2: 541-330LCT-ND; Supplier Part Number 1: 71-CRCW0402-330-E3; Mouser Part Number: 71-CRCW0402-330-E3
R2 = Resistor - 47K: as R69 on sheet 5V Buck Boost Converter; Height: 0.4mm; ComponentLink1Description: DataSheet; ComponentLink1URL: https://www.mouser.com.tr/datasheet/2/427/dcrcwe3-1762152.pdf; ComponentLink2Description: Mouser; ComponentLink2URL: https://www.mouser.com.tr/ProductDetail/Vishay-Dale/CRCW040247K0FKED?qs=sGAEpiMZZMu61qfTUdNhG2DpbjADlD3GL%252B3h1elTxqU%3D; Supplier 1: Mouser; Supplier 2: Digi-Key; Supplier Part Number 1: 71-CRCW040247K0FKEDH; Supplier Part Number 2: 541-47.0KYCT-ND; Mouser Part Number: 71-CRCW0402-47K-E3
U1 = IC - TPS22917DBVR: Power Switch MosFet; Height: 1.45mm; ComponentLink1Description: DataSheet; ComponentLink1URL: http://www.ti.com/lit/gpn/tps22917; ComponentLink2Description: Mouser; ComponentLink2URL: https://www.mouser.com/Search/Refine.aspx?Keyword=595-TPS22917DBVR; Supplier 1: Mouser; Supplier 2: Digi-Key; Supplier Part Number 1: 595-TPS22917DBVR; Supplier Part Number 2: 296-50498-1-ND; Mouser Part Number: 595-TPS22917DBVR; Case: SOT-23-6

## Sheet Main Power Switch.SchDoc: Main Power Switch
size A4; ApprovedBy: Mehmet Günce Akkoyun; CheckedBy: Mehmet Günce Akkoyun; Author: Mehmet Günce Akkoyun; CompanyName: Ovoo Electronics; DrawnBy: Mehmet Günce Akkoyun; Engineer: Mehmet Günce Akkoyun; Organization: Ovoo Electronics; Address1: Necip Fazýl Mah. Ortaýrmak Sok.; Address2: Birgül Apt. No: 19/6; Address3: Meram / Konya; Address4: Turkiye; DocumentNumber: 6; Revision: R06; SheetNumber: 6; SheetTotal: 54
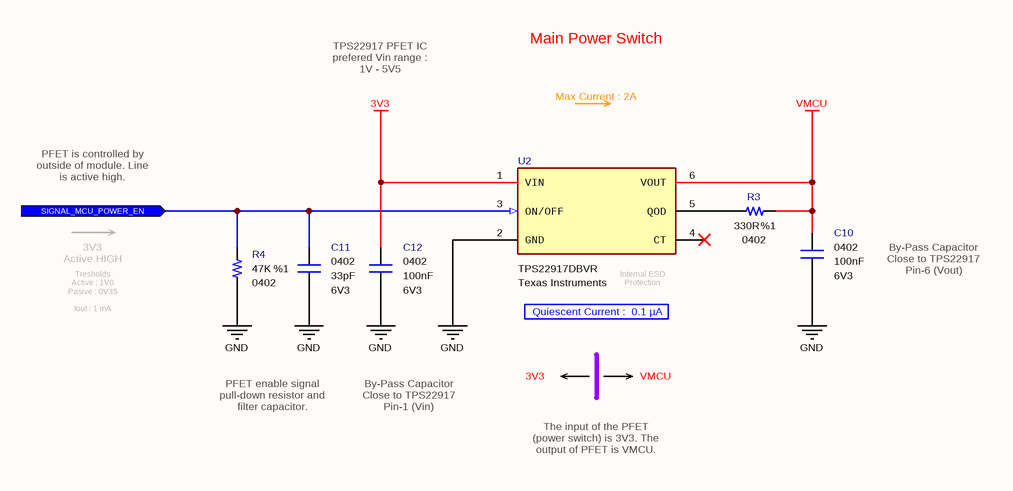
[diagram p4: Main Power Switch.SchDoc]

### Parts
C10  value 100nF  Case: 0402  Voltage: 6V3  [CAPACITOR_0402]  (hidden comment: Multilayer Ceramic Capacitor)
C11  value 33pF  Case: 0402  Voltage: 6V3  [CAPACITOR_0402]  (hidden comment: Multilayer Ceramic Capacitor)
C12  value 100nF  Case: 0402  Voltage: 6V3  [CAPACITOR_0402]  (hidden comment: Multilayer Ceramic Capacitor)
R3  value 330R  Tolerance: %1  Case: 0402  [RESISTOR_0402]  (hidden comment: Thick Film Resistor)
R4  value 47K  Tolerance: %1  Case: 0402  [RESISTOR_0402]  (hidden comment: Thick Film Resistor)
U2  Manufacturer Part Number: TPS22917DBVR  Manufacturer Name: Texas Instruments  [SOT-23-6]  (hidden comment: Power Switch)

### Ports
SIGNAL_MCU_POWER_EN (in)

### Nets
3V3: C12.1 U2.1(VIN)
GND: C10.2 C11.1 C12.2 R4.1 U2.2(GND)
VMCU: C10.1 R3.1 U2.6(VOUT)
NetC11_2: C11.2 R4.2 U2.3(ON/OFF) ; port SIGNAL_MCU_POWER_EN
NetR3_2: R3.2 U2.5(QOD)

Not connected (* = marked no-connect by the designer): U2 4(CT)*

### Notes on the sheet
- Main Power Switch
- TPS22917 PFET IC prefered Vin range : 1V - 5V5
- Max Current : 2A
- PFET is controlled by outside of module. Line is active high.
- 3V3
  Active HIGH
- (near U2) Internal ESD Protection
- By-Pass Capacitor
  Close to TPS22917
  Pin-6 (Vout)
- Tresholds
  Active : 1V0
  Pasive : 0V35
  Iout : 1 mA
- Quiescent Current :  0.1 µA
- PFET enable signal pull-down resistor and filter capacitor.
- By-Pass Capacitor
  Close to TPS22917
  Pin-1 (Vin)
- 3V3
- VMCU
- The input of the PFET (power switch) is 3V3. The output of PFET is VMCU.
- Engineer
- All Rights are reserved to Customer and Engineer. [2021]
- Size:
- Date:
- A4
- Project :
- Time:
- Sheet
- of
- Customer
- Product ID
- Module ID
- Version
- File:
- Revision

### Library data of the parts
C10 C12 = Capacitor - 100nF [0402-6V3]: as C223 on sheet 3V8 Buck Boost Converter; Height: 0.25mm; ComponentLink1Description: Mouser; ComponentLink1URL: https://www.mouser.com.tr/ProductDetail/AVX/04026D104KAT4A?qs=sGAEpiMZZMs0AnBnWHyRQPg4iYkCw7IMED%2F4kpqgf7w%3D; ComponentLink2Description: DataSheet; ComponentLink2URL: https://www.mouser.com.tr/datasheet/2/40/cx5r-776519.pdf; ROHS: Yes; Maximum Operating Temperature: +85; Minimum Operating Temperature: -55; Supplier 1: Avnet; Supplier Part Number 1: 04026D104KAT4A; Mouser Part Number: 581-04026D104KAT4A
C11 = Capacitor - 33pF [0402-6V3]: as C222 on sheet 3V8 Buck Boost Converter; Height: 0.5mm; Maximum Operating Temperature: +125; Minimum Operating Temperature: -55; ROHS: Yes; ComponentLink1Description: DataSheet; ComponentLink1URL: https://api.kemet.com/component-edge/download/datasheet/C0402C330J9RACAUTO.pdf; ComponentLink2Description: Mouser; ComponentLink2URL: https://www.mouser.com/Search/Refine.aspx?Keyword=80-C0402C330J9RAUTO; Supplier 1: Mouser; Supplier Part Number 1: 80-C0402C330J9RAUTO; Mouser Part Number: 80-C0402C330J9RAUTO
R3 = Resistor - 330R: as R1 on sheet GSM Power; Height: 0.4mm; ComponentLink1Description: DataSheet; ComponentLink1URL: https://www.mouser.com.tr/datasheet/2/427/dcrcwe3-1762152.pdf; ComponentLink2Description: Mouser; ComponentLink2URL: https://www.mouser.com.tr/ProductDetail/Vishay-Dale/CRCW0402330RFKED?qs=sGAEpiMZZMu61qfTUdNhG2DpbjADlD3GGS6SwBlLi5Q%3D; Supplier 1: Mouser; Supplier 2: Digi-Key; Supplier Part Number 2: 541-330LCT-ND; Supplier Part Number 1: 71-CRCW0402-330-E3; Mouser Part Number: 71-CRCW0402-330-E3
R4 = Resistor - 47K: as R69 on sheet 5V Buck Boost Converter; Height: 0.4mm; ComponentLink1Description: DataSheet; ComponentLink1URL: https://www.mouser.com.tr/datasheet/2/427/dcrcwe3-1762152.pdf; ComponentLink2Description: Mouser; ComponentLink2URL: https://www.mouser.com.tr/ProductDetail/Vishay-Dale/CRCW040247K0FKED?qs=sGAEpiMZZMu61qfTUdNhG2DpbjADlD3GL%252B3h1elTxqU%3D; Supplier 1: Mouser; Supplier 2: Digi-Key; Supplier Part Number 1: 71-CRCW040247K0FKEDH; Supplier Part Number 2: 541-47.0KYCT-ND; Mouser Part Number: 71-CRCW0402-47K-E3
U2 = IC - TPS22917DBVR: Power Switch MosFet; Height: 1.45mm; ComponentLink1Description: DataSheet; ComponentLink1URL: http://www.ti.com/lit/gpn/tps22917; ComponentLink2Description: Mouser; ComponentLink2URL: https://www.mouser.com/Search/Refine.aspx?Keyword=595-TPS22917DBVR; Supplier 1: Mouser; Supplier 2: Digi-Key; Supplier Part Number 1: 595-TPS22917DBVR; Supplier Part Number 2: 296-50498-1-ND; Mouser Part Number: 595-TPS22917DBVR; Case: SOT-23-6

## Sheet GE910QUAD Modem.SchDoc: GE910 GSM Modem & SIM
size A3; ApprovedBy: Mehmet Günce Akkoyun; CheckedBy: Mehmet Günce Akkoyun; Author: Mehmet Günce Akkoyun; CompanyName: Ovoo Electronics; DrawnBy: Mehmet Günce Akkoyun; Engineer: Mehmet Günce Akkoyun; Organization: Ovoo Electronics; Address1: Necip Fazýl Mah. Ortaýrmak Sok.; Address2: Birgül Apt. No: 19/6; Address3: Meram / Konya; Address4: Turkiye; DocumentNumber: 9; Revision: R06; SheetNumber: 9; SheetTotal: 54
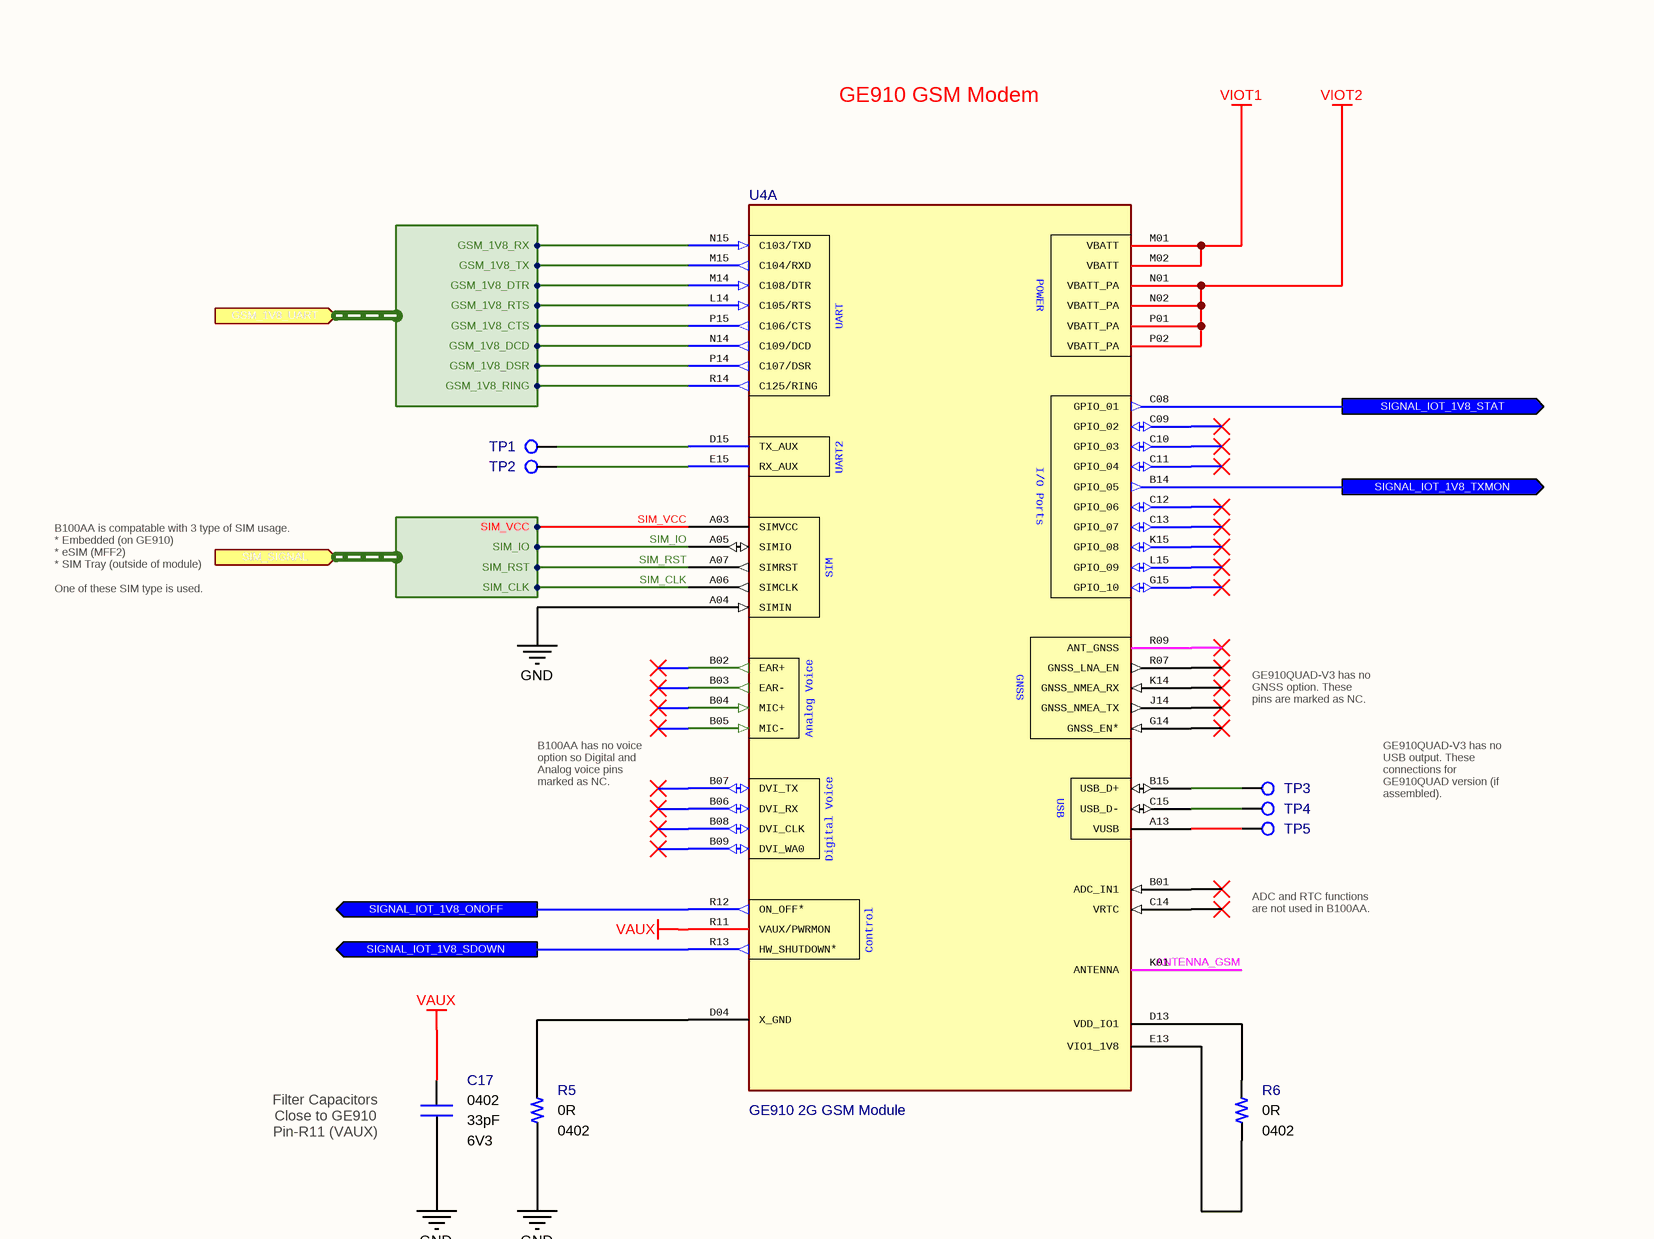
[diagram p5: GE910QUAD Modem.SchDoc, top left]
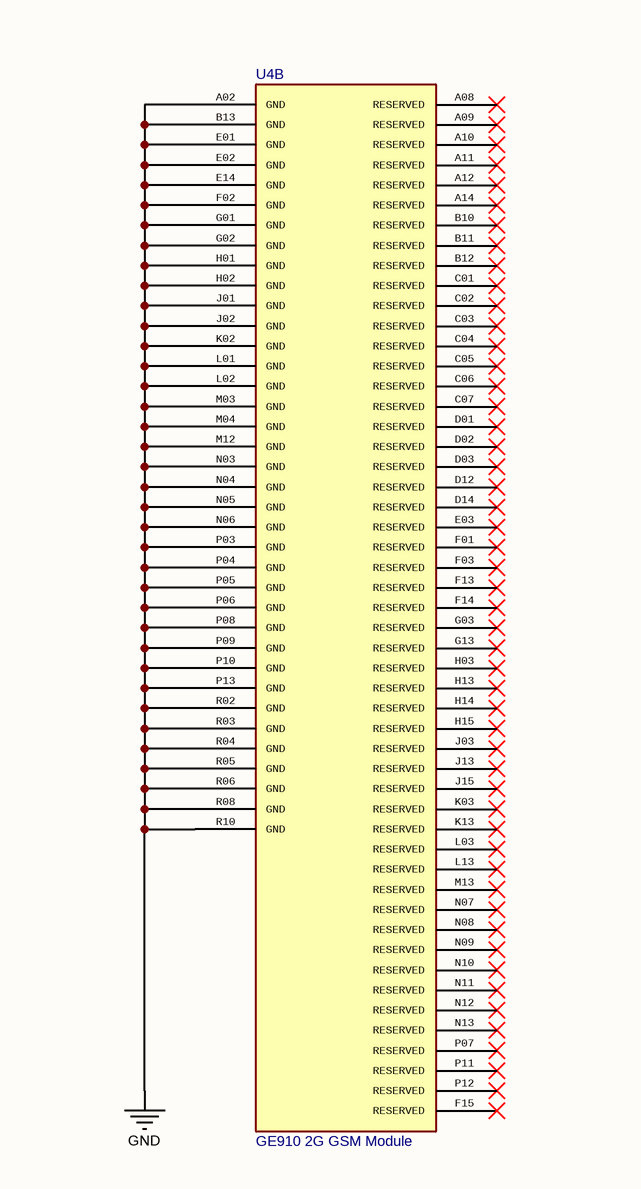
[diagram p6: GE910QUAD Modem.SchDoc, top right]
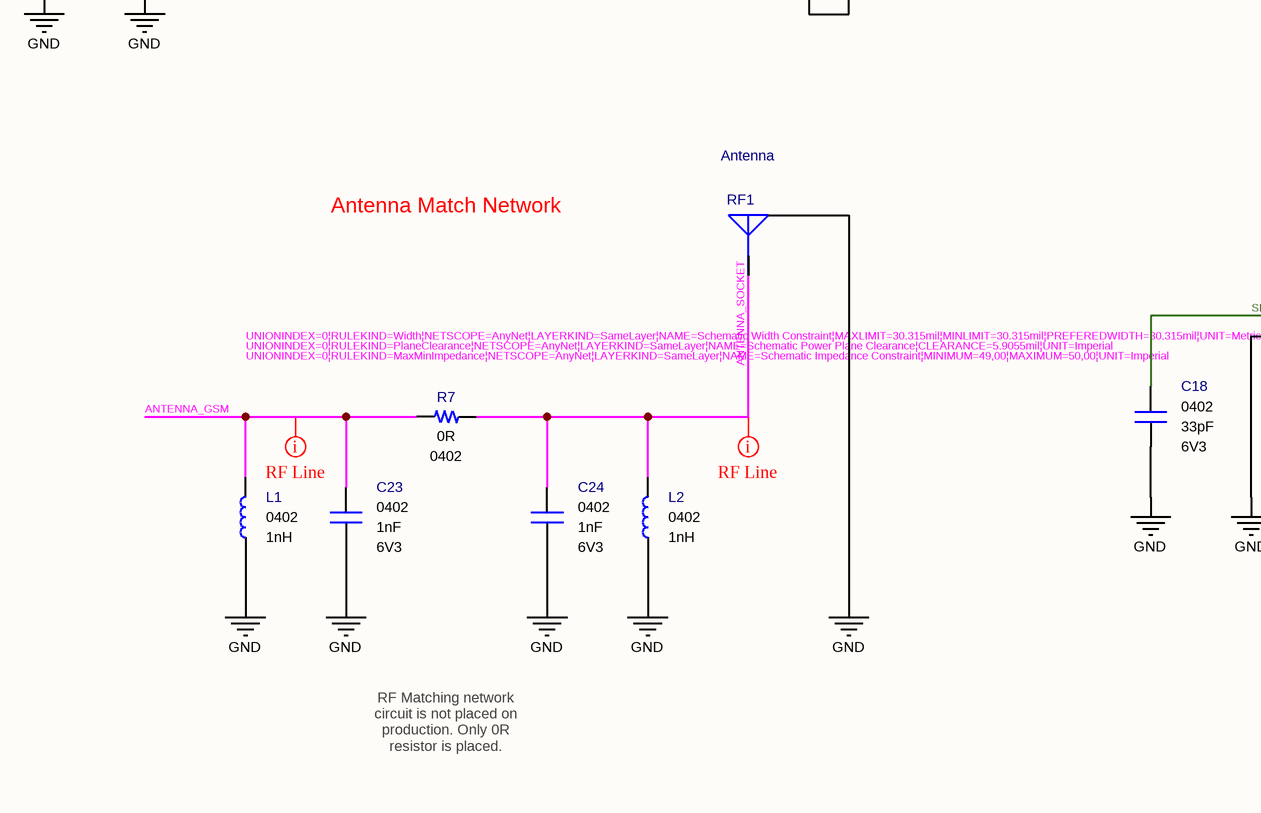
[diagram p7: GE910QUAD Modem.SchDoc, bottom left]
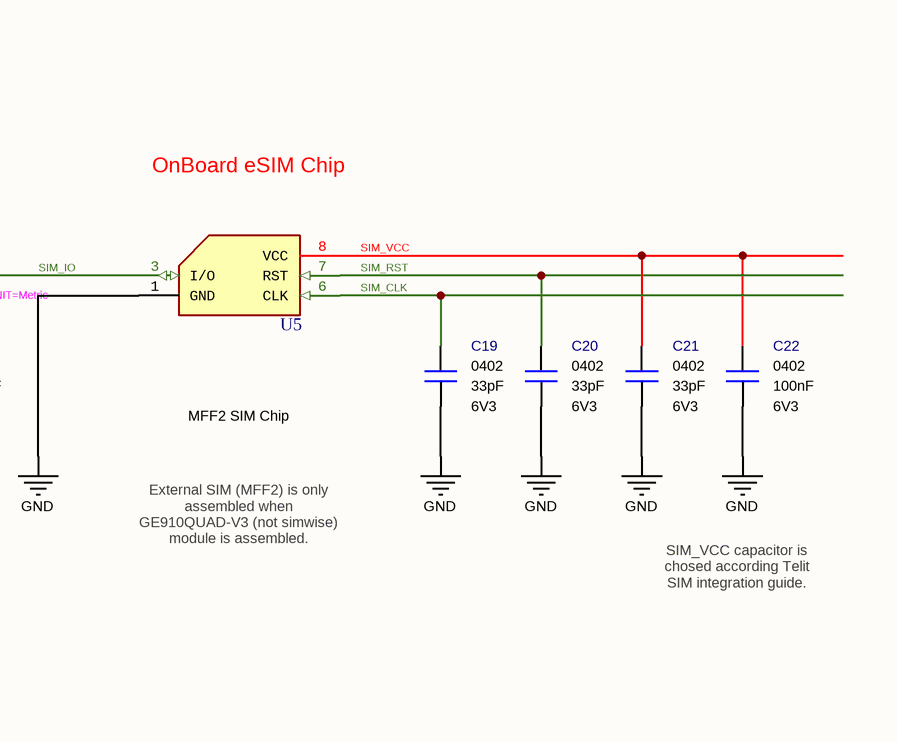
[diagram p8: GE910QUAD Modem.SchDoc, bottom right]

### Parts
C17  value 33pF  Case: 0402  Voltage: 6V3  [CAPACITOR_0402]  (hidden comment: Multilayer Ceramic Capacitor)
C18  value 33pF  Case: 0402  Voltage: 6V3  [CAPACITOR_0402]  (hidden comment: Multilayer Ceramic Capacitor)
C19  value 33pF  Case: 0402  Voltage: 6V3  [CAPACITOR_0402]  (hidden comment: Multilayer Ceramic Capacitor)
C20  value 33pF  Case: 0402  Voltage: 6V3  [CAPACITOR_0402]  (hidden comment: Multilayer Ceramic Capacitor)
C21  value 33pF  Case: 0402  Voltage: 6V3  [CAPACITOR_0402]  (hidden comment: Multilayer Ceramic Capacitor)
C22  value 100nF  Case: 0402  Voltage: 6V3  [CAPACITOR_0402]  (hidden comment: Multilayer Ceramic Capacitor)
C23  value 1nF  Case: 0402  Voltage: 6V3  [CAPACITOR_0402]  (hidden comment: Multilayer Ceramic Capacitor)
C24  value 1nF  Case: 0402  Voltage: 6V3  [CAPACITOR_0402]  (hidden comment: Multilayer Ceramic Capacitor)
L1  value 1nH  Case: 0402  [INDUCTOR_0402]  (hidden comment: Fixed Inductor)
L2  value 1nH  Case: 0402  [INDUCTOR_0402]  (hidden comment: Fixed Inductor)
R5  value 0R  Case: 0402  [RESISTOR_0402]  (hidden comment: Thick Film Resistor)
R6  value 0R  Case: 0402  [RESISTOR_0402]  (hidden comment: Thick Film Resistor)
R7  value 0R  Case: 0402  [RESISTOR_0402]  (hidden comment: Thick Film Resistor)
RF1  Antenna  [Connector_IPEX]
TP1  PCB - Test Point  [Test_Point]  (value not drawn)  (no BOM)
TP2  PCB - Test Point  [Test_Point]  (value not drawn)  (no BOM)
TP3  PCB - Test Point  [Test_Point]  (value not drawn)  (no BOM)
TP4  PCB - Test Point  [Test_Point]  (value not drawn)  (no BOM)
TP5  PCB - Test Point  [Test_Point]  (value not drawn)  (no BOM)
U4  GE910 2G GSM Module  [GE910 2G GSM Modem]  (parts A,B of 2)
U5  MFF2 SIM Chip  [MFF2]

### Ports
GSM_1V8_UART (in, harness GSM_1V8_UART), SIGNAL_IOT_1V8_ONOFF (out), SIGNAL_IOT_1V8_SDOWN (out), SIGNAL_IOT_1V8_STAT (out), SIGNAL_IOT_1V8_TXMON (out), SIM_SIGNAL (in, harness SIM_SIGNAL)

### Harnesses
GSM_1V8_UART: GSM_1V8_RX, GSM_1V8_TX, GSM_1V8_DTR, GSM_1V8_RTS, GSM_1V8_CTS, GSM_1V8_DCD, GSM_1V8_DSR, GSM_1V8_RING
SIM_SIGNAL: SIM_VCC, SIM_IO, SIM_RST, SIM_CLK

### Nets
GND: C17.1 C18.1 C19.1 C20.1 C21.1 C22.1 C23.1 C24.1 L1.1 L2.1 R5.1 RF1.2(GND) U4.A02(GND) U4.A04(SIMIN) U4.B13(GND) U4.E01(GND) U4.E02(GND) U4.E14(GND) U4.F02(GND) U4.G01(GND) U4.G02(GND) U4.H01(GND) U4.H02(GND) U4.J01(GND) U4.J02(GND) U4.K02(GND) U4.L01(GND) U4.L02(GND) U4.M03(GND) U4.M04(GND) U4.M12(GND) U4.N03(GND) U4.N04(GND) U4.N05(GND) U4.N06(GND) U4.P03(GND) U4.P04(GND) U4.P05(GND) U4.P06(GND) U4.P08(GND) U4.P09(GND) U4.P10(GND) U4.P13(GND) U4.R02(GND) U4.R03(GND) U4.R04(GND) U4.R05(GND) U4.R06(GND) U4.R08(GND) U4.R10(GND) U5.1(GND)
VAUX: C17.2 U4.R11(VAUX/PWRMON)
VIOT1: U4.M01(VBATT) U4.M02(VBATT)
VIOT2: U4.N01(VBATT_PA) U4.N02(VBATT_PA) U4.P01(VBATT_PA) U4.P02(VBATT_PA)
ANTENNA_GSM: C23.2 L1.2 R7.2 U4.K01(ANTENNA)
ANTENNA_SOCKET: C24.2 L2.2 R7.1 RF1.1(Signal)
SIM_CLK: C19.2 U4.A06(SIMCLK) U5.6(CLK) ; port SIM_SIGNAL.SIM_CLK
SIM_IO: C18.2 U4.A05(SIMIO) U5.3(I/O) ; port SIM_SIGNAL.SIM_IO
SIM_RST: C20.2 U4.A07(SIMRST) U5.7(RST) ; port SIM_SIGNAL.SIM_RST
SIM_VCC: C21.2 C22.2 U4.A03(SIMVCC) U5.8(VCC) ; port SIM_SIGNAL.SIM_VCC
NetR5_2: R5.2 U4.D04(X_GND)
NetR6_1: R6.1 U4.E13(VIO1_1V8)
NetR6_2: R6.2 U4.D13(VDD_IO1)
NetTP1_1: TP1.1 U4.D15(TX_AUX)
NetTP2_1: TP2.1 U4.E15(RX_AUX)
NetTP3_1: TP3.1 U4.B15(USB_D+)
NetTP4_1: TP4.1 U4.C15(USB_D-)
NetTP5_1: TP5.1 U4.A13(VUSB)
NetU4_B14: U4.B14(GPIO_05) ; port SIGNAL_IOT_1V8_TXMON
NetU4_C08: U4.C08(GPIO_01) ; port SIGNAL_IOT_1V8_STAT
NetU4_L14: U4.L14(C105/RTS) ; port GSM_1V8_UART.GSM_1V8_RTS
NetU4_M14: U4.M14(C108/DTR) ; port GSM_1V8_UART.GSM_1V8_DTR
NetU4_M15: U4.M15(C104/RXD) ; port GSM_1V8_UART.GSM_1V8_TX
NetU4_N14: U4.N14(C109/DCD) ; port GSM_1V8_UART.GSM_1V8_DCD
NetU4_N15: U4.N15(C103/TXD) ; port GSM_1V8_UART.GSM_1V8_RX
NetU4_P14: U4.P14(C107/DSR) ; port GSM_1V8_UART.GSM_1V8_DSR
NetU4_P15: U4.P15(C106/CTS) ; port GSM_1V8_UART.GSM_1V8_CTS
NetU4_R12: U4.R12(ON_OFF*) ; port SIGNAL_IOT_1V8_ONOFF
NetU4_R13: U4.R13(HW_SHUTDOWN*) ; port SIGNAL_IOT_1V8_SDOWN
NetU4_R14: U4.R14(C125/RING) ; port GSM_1V8_UART.GSM_1V8_RING

Not connected (* = marked no-connect by the designer): U4 A08(RESERVED)* A09(RESERVED)* A10(RESERVED)* A11(RESERVED)* A12(RESERVED)* A14(RESERVED)* B01(ADC_IN1)* B02(EAR+)* B03(EAR-)* B04(MIC+)* B05(MIC-)* B06(DVI_RX)* B07(DVI_TX)* B08(DVI_CLK)* B09(DVI_WA0)* B10(RESERVED)* B11(RESERVED)* B12(RESERVED)* C01(RESERVED)* C02(RESERVED)* C03(RESERVED)* C04(RESERVED)* C05(RESERVED)* C06(RESERVED)* C07(RESERVED)* C09(GPIO_02)* C10(GPIO_03)* C11(GPIO_04)* C12(GPIO_06)* C13(GPIO_07)* C14(VRTC)* D01(RESERVED)* D02(RESERVED)* D03(RESERVED)* D12(RESERVED)* D14(RESERVED)* E03(RESERVED)* F01(RESERVED)* F03(RESERVED)* F13(RESERVED)* F14(RESERVED)* F15(RESERVED)* G03(RESERVED)* G13(RESERVED)* G14(GNSS_EN*)* G15(GPIO_10)* H03(RESERVED)* H13(RESERVED)* H14(RESERVED)* H15(RESERVED)* J03(RESERVED)* J13(RESERVED)* J14(GNSS_NMEA_TX)* J15(RESERVED)* K03(RESERVED)* K13(RESERVED)* K14(GNSS_NMEA_RX)* K15(GPIO_08)* L03(RESERVED)* L13(RESERVED)* L15(GPIO_09)* M13(RESERVED)* N07(RESERVED)* N08(RESERVED)* N09(RESERVED)* N10(RESERVED)* N11(RESERVED)* N12(RESERVED)* N13(RESERVED)* P07(RESERVED)* P11(RESERVED)* P12(RESERVED)* R07(GNSS_LNA_EN)* R09(ANT_GNSS)*; U5 2(NC) 4(NC) 5(NC)

### Layout directives
rule Impedance Constraint [Min = 49.00    Max = 50.00    ]; rule Power Plane Clearance [Clearance = 5.906mil]; rule Width Constraint [Pref Width = 0.77mm    Min Width = 0.77mm    Max Width = 0.77mm]: ANTENNA_GSM, ANTENNA_SOCKET

### Notes on the sheet
- GE910 GSM Modem
- B100AA is compatable with 3 type of SIM usage.
  * Embedded (on GE910)
  * eSIM (MFF2)
  * SIM Tray (outside of module)
  One of these SIM type is used.
- GE910QUAD-V3 has no GNSS option. These pins are marked as NC.
- B100AA has no voice option so Digital and Analog voice pins marked as NC.
- GE910QUAD-V3 has no USB output. These connections for GE910QUAD version (if assembled).
- ADC and RTC functions are not used in B100AA.
- (near C17) Filter Capacitors
  Close to GE910
  Pin-R11 (VAUX)
- Antenna Match Network
- (near U5) OnBoard eSIM Chip
- External SIM (MFF2) is only assembled when GE910QUAD-V3 (not simwise) module is assembled.
- SIM_VCC capacitor is chosed according Telit SIM integration guide.
- RF Matching network circuit is not placed on production. Only 0R resistor is placed.
- Engineer
- All Rights are reserved to Customer and Engineer. [2021]
- Size:
- Date:
- A3
- Project :
- Time:
- Sheet
- of
- Customer
- Product ID
- Module ID
- Version
- File:
- Revision
- (in symbol IC - Telit GE910QUAD, part A) POWER; UART; UART2; I/O Ports; SIM; GNSS; Analog Voice; USB; Digital Voice; Control

### Library data of the parts
C17-C21 = Capacitor - 33pF [0402-6V3]: as C222 on sheet 3V8 Buck Boost Converter; Height: 0.5mm; Maximum Operating Temperature: +125; Minimum Operating Temperature: -55; ROHS: Yes; ComponentLink1Description: DataSheet; ComponentLink1URL: https://api.kemet.com/component-edge/download/datasheet/C0402C330J9RACAUTO.pdf; ComponentLink2Description: Mouser; ComponentLink2URL: https://www.mouser.com/Search/Refine.aspx?Keyword=80-C0402C330J9RAUTO; Supplier 1: Mouser; Supplier Part Number 1: 80-C0402C330J9RAUTO; Mouser Part Number: 80-C0402C330J9RAUTO
C22 = Capacitor - 100nF [0402-6V3]: as C223 on sheet 3V8 Buck Boost Converter; Height: 0.25mm; ComponentLink1Description: Mouser; ComponentLink1URL: https://www.mouser.com.tr/ProductDetail/AVX/04026D104KAT4A?qs=sGAEpiMZZMs0AnBnWHyRQPg4iYkCw7IMED%2F4kpqgf7w%3D; ComponentLink2Description: DataSheet; ComponentLink2URL: https://www.mouser.com.tr/datasheet/2/40/cx5r-776519.pdf; ROHS: Yes; Maximum Operating Temperature: +85; Minimum Operating Temperature: -55; Supplier 1: Avnet; Supplier Part Number 1: 04026D104KAT4A; Mouser Part Number: 581-04026D104KAT4A
C23 C24 = Capacitor - 1nF [0402-6V3]: Capacitor - 1nF [0402] (Ceramic); Manufacturer Name: AVX; Manufacturer Part Number: 04026C102MAT2A; Dielectric: X7R; Tolerance: 20%; Height: 0.25mm; Mouser Price/Stock: 0.074; Maximum Operating Temperature: +125; Minimum Operating Temperature: -55; ROHS: Yes; Weight: 0.65mg; ComponentLink1Description: DataSheet; ComponentLink1URL: https://www.mouser.com.tr/datasheet/2/40/X7RDielectric-777024.pdf; Supplier 1: Mouser; Supplier Part Number 1: 581-04026C102MAT2A; Mouser Part Number: 581-04026C102MAT2A; ComponentLink2Description: Mouser; ComponentLink2URL: https://www.mouser.com.tr/ProductDetail/AVX/04026C102MAT2A/?qs=%2Fha2pyFaduih52wBA08yQb8Fl0MEN8ljDrRW0UuYpjAzFvrGZxsBOQ%3D%3D
L1 L2 = Inductor - 1nH [0402]: Manufacturer Name: Murata Electronics; Manufacturer Part Number: LQG15HN1N0S02D; Tolerance: 0.3 nH; Height: 0.35mm; ComponentLink1Description: DataSheet; ComponentLink1URL: https://www.mouser.com.tr/datasheet/2/281/JELF243B-0009-1699631.pdf; ComponentLink2Description: Mouser; ComponentLink2URL: https://www.mouser.com.tr/ProductDetail/Murata-Electronics/LQG15HN1N0S02D?qs=sGAEpiMZZMsg%252By3WlYCkUySk0uOsB1dTfJeMbA4C8Pk%3D; Supplier 1: Future Electronics; Supplier 2: Future Electronics; Supplier 3: Mouser; Supplier 4: Arrow; Supplier 5: Digi-Key; Supplier Part Number 1: LQG15HN1N0S02D-CUTT; Supplier Part Number 2: LQG15HN1N0S02D-REEL; Supplier Part Number 3: 81-LQG15HN1N0S02D; Supplier Part Number 4: LQG15HN1N0S02D; Supplier Part Number 5: 490-1073-1-ND; Mouser Part Number: 81-LQG15HN1N0S02D
R5-R7 = Resistor - 0R: Thick Film Resistors - SMD 1/16 W 0 Ohms; Manufacturer Name: Vishay; Manufacturer Part Number: CRCW04020000Z0ED; Height: 0.4mm; ComponentLink1Description: DataSheet; ComponentLink1URL: https://www.mouser.com.tr/datasheet/2/427/dcrcwe3-1762152.pdf; ComponentLink2Description: Mouser; ComponentLink2URL: https://www.mouser.com.tr/ProductDetail/Vishay-Dale/CRCW04020000Z0ED?qs=sGAEpiMZZMu61qfTUdNhG2DpbjADlD3GG34cJb50zyg%3D; Supplier 1: Mouser; Supplier 2: Digi-Key; Supplier Part Number 1: 71-CRCW0402-0-E3; Supplier Part Number 2: 541-0.0JCT-ND; Mouser Part Number: 71-CRCW0402-0-E3
RF1 = Connector - MHF: MHF Antenna Socket; ROHS: Yes; Supplier 1: Mouser; Supplier 2: Arrow; Supplier Part Number 1: 200-RSP-122811-01; Supplier Part Number 2: RSP-122811-01; Case: SMD
TP1-TP5 = PCB - Test Point: Test Point
U4 = IC - Telit GE910QUAD: Telit GE910 GPRS/UMTS Module; ComponentLink1Description: Product Page; ComponentLink1URL: https://www.telit.com/product-series/ge910/; Manufacturer Name: Telit; Manufacturer Part Number: GE910QUAD; Case: BGA
U5 = IC - MFF2: SIM Chip MFF2